# EAGLE design Nivel_inferior (EAGLE 7.6.0)
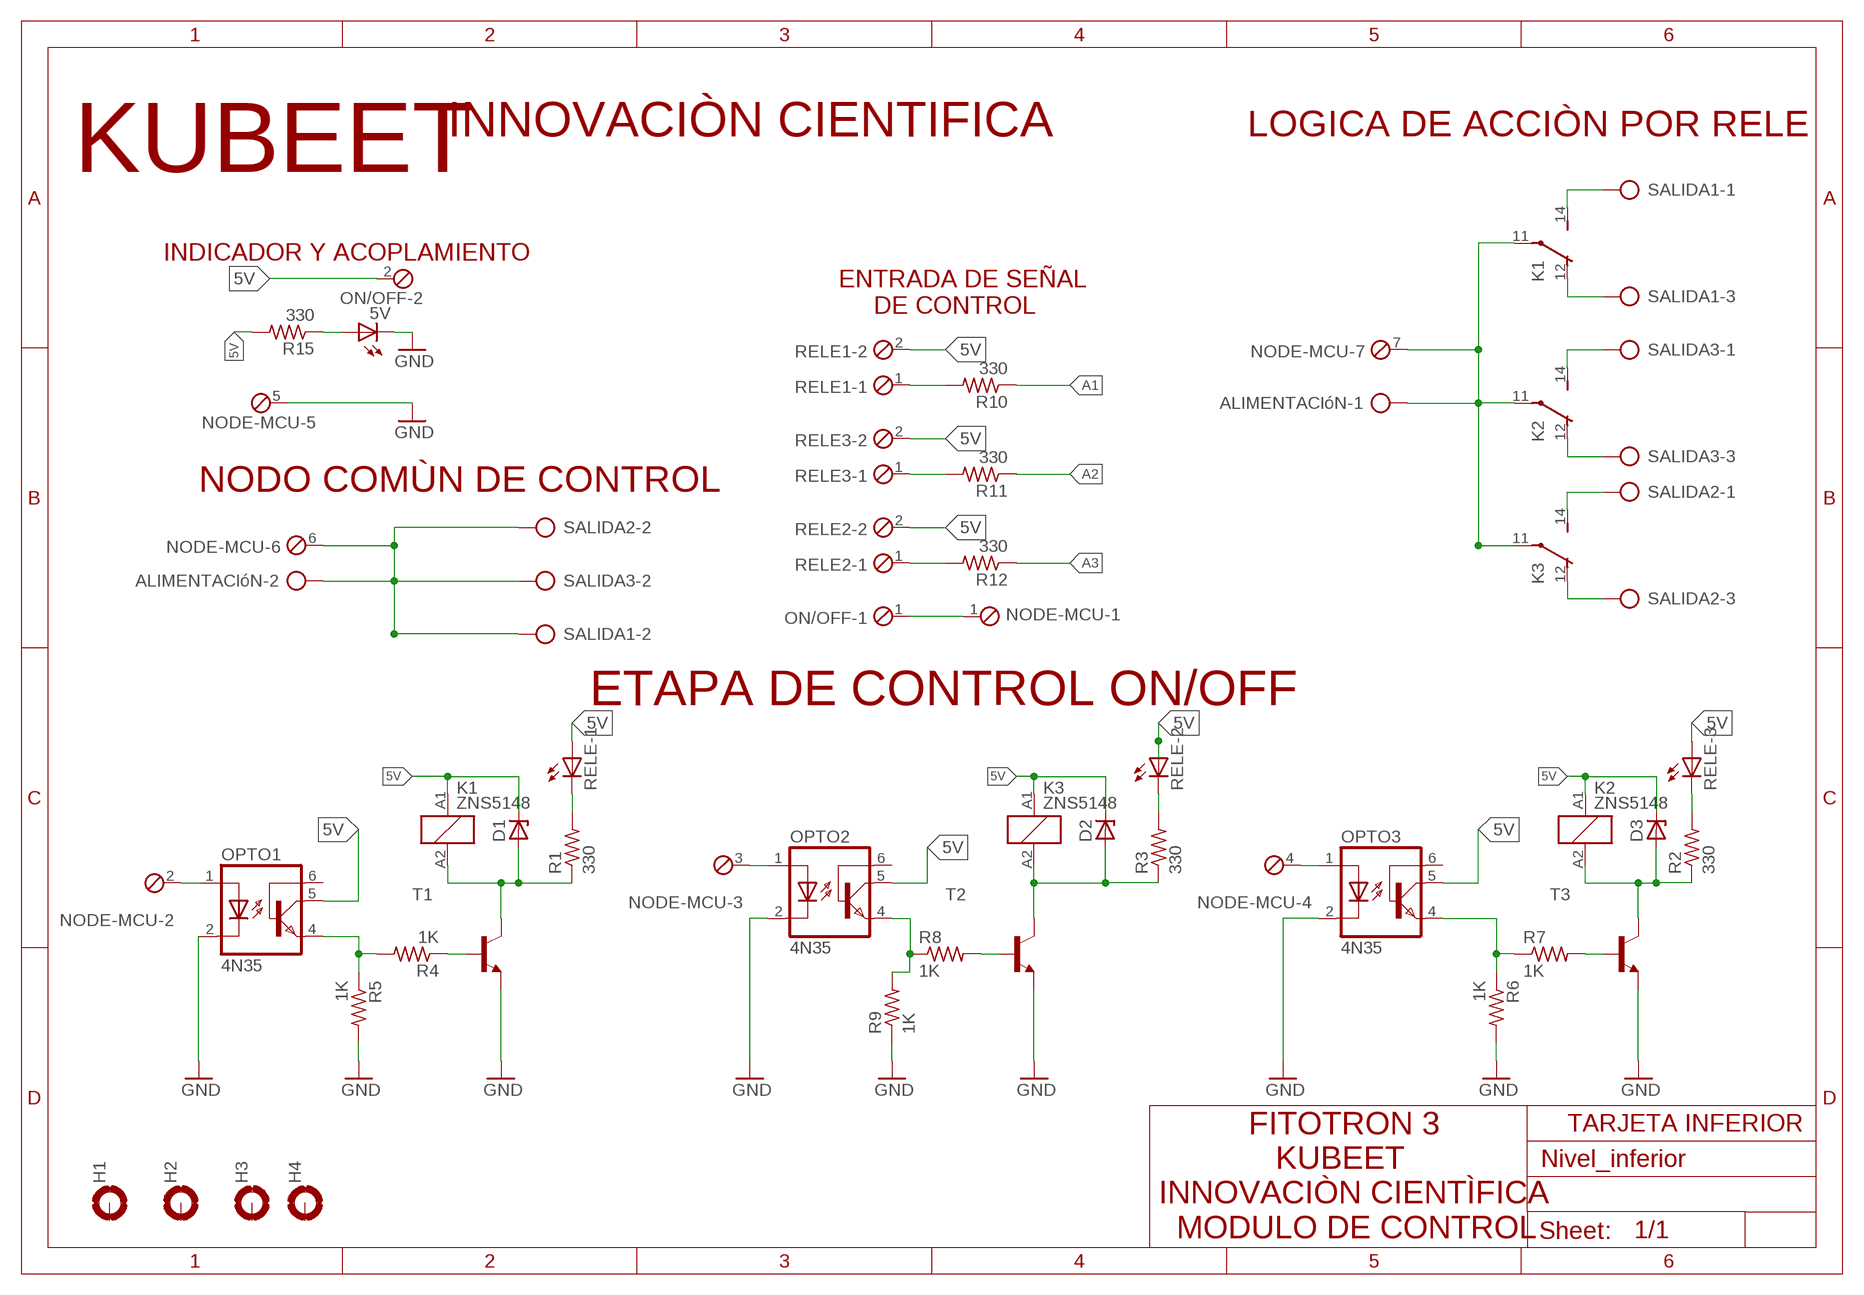
[diagram p0: schematic, sheet 1]

## Parts
5V  LED5MM  [LED5MM]
ALIMENTACIóN  AK300/2  [AK300/2]
D1  1N821  [DO35Z10]
D2  1N821  [DO35Z10]
D3  1N821  [DO35Z10]
H1  MOUNT-PAD-ROUND3.6  [3,6-PAD]
H2  MOUNT-PAD-ROUND3.6  [3,6-PAD]
H3  MOUNT-PAD-ROUND3.6  [3,6-PAD]
H4  MOUNT-PAD-ROUND3.6  [3,6-PAD]
K1  ZNS5148  [ZN5]
K2  ZNS5148  [ZN5]
K3  ZNS5148  [ZN5]
NODE-MCU  MPT7  [7POL254]
ON/OFF  MPT2  [2POL254]
OPTO1  4N35  [DIL06]
OPTO2  4N35  [DIL06]
OPTO3  4N35  [DIL06]
R1  330  R-US_0207/7  [0207/7]
R2  330  R-US_0207/7  [0207/7]
R3  330  R-US_0207/7  [0207/7]
R4  1K  R-US_0207/7  [0207/7]
R5  1K  R-US_0207/7  [0207/7]
R6  1K  R-US_0207/7  [0207/7]
R7  1K  R-US_0207/7  [0207/7]
R8  1K  R-US_0207/7  [0207/7]
R9  1K  R-US_0207/7  [0207/7]
R10  330  R-US_0207/7  [0207/7]
R11  330  R-US_0207/7  [0207/7]
R12  330  R-US_0207/7  [0207/7]
R15  330  R-US_0207/7  [0207/7]
RELE1  MPT2  [2POL254]
RELE2  MPT2  [2POL254]
RELE3  MPT2  [2POL254]
RELE-1  LED5MM  [LED5MM]
RELE-2  LED5MM  [LED5MM]
RELE-3  LED5MM  [LED5MM]
SALIDA1  AK300/3  [AK300/3]
SALIDA2  AK300/3  [AK300/3]
SALIDA3  AK300/3  [AK300/3]
T1  2N2222-NPN-TO92-EBC  [TO92-EBC]
T2  2N2222-NPN-TO92-EBC  [TO92-EBC]
T3  2N2222-NPN-TO92-EBC  [TO92-EBC]

## Nets
5V: D1.C D2.C D3.C K1.A1 K2.A1 K3.A1 ON/OFF.2 OPTO1.5(COL) OPTO2.5(COL) OPTO3.5(COL) R15.2 RELE1.2 RELE2.2 RELE3.2 RELE-1.A RELE-2.A RELE-3.A
A: ALIMENTACIóN.1 K1.11(2:P) K2.11(2:P) K3.11(2:P) NODE-MCU.7
A1: NODE-MCU.2 OPTO1.1(A) R10.1
A2: NODE-MCU.4 OPTO3.1(A) R11.1
A3: NODE-MCU.3 OPTO2.1(A) R12.1
GND: 5V.K(C) NODE-MCU.5 OPTO1.2(C) OPTO2.2(C) OPTO3.2(C) R5.2 R6.2 R9.1 T1.E T2.E T3.E
N$1: ALIMENTACIóN.2 NODE-MCU.6 SALIDA1.2 SALIDA2.2 SALIDA3.2
N$4: K1.14(2:S) SALIDA1.1
N$5: K1.12(2:O) SALIDA1.3
N$6: K2.14(2:S) SALIDA3.1
N$7: K2.12(2:O) SALIDA3.3
N$8: K3.14(2:S) SALIDA2.1
N$9: K3.12(2:O) SALIDA2.3
N$10: NODE-MCU.1 ON/OFF.1
N$15: D1.A K1.A2 R1.1 T1.C
N$16: D3.A K2.A2 R2.1 T3.C
N$18: 5V.A R15.1
N$59: D2.A K3.A2 R3.1 T2.C
N$74: R12.2 RELE2.1
N$140: R1.2 RELE-1.K(C)
N$141: R2.2 RELE-3.K(C)
N$142: R3.2 RELE-2.K(C)
N$146: R7.2 T3.B
N$147: R4.1 T1.B
N$148: OPTO1.4(EMI) R4.2 R5.1
N$149: OPTO3.4(EMI) R6.1 R7.1
N$150: R8.2 T2.B
N$151: OPTO2.4(EMI) R8.1 R9.2
N$162: R11.2 RELE3.1
N$164: R10.2 RELE1.1
Unconnected: H1.B3,6(MOUNT) H2.B3,6(MOUNT) H3.B3,6(MOUNT) H4.B3,6(MOUNT) OPTO1.6(BAS) OPTO2.6(BAS) OPTO3.6(BAS)

## Notes on the sheet
- INNOVACIÒN CIENTIFICA | LOGICA DE ACCIÒN POR RELE
- KUBEET
- INDICADOR Y ACOPLAMIENTO
- ENTRADA DE SEÑAL 
       DE CONTROL
- NODO COMÙN DE CONTROL
- ETAPA DE CONTROL ON/OFF
- TARJETA INFERIOR
- FITOTRON 3
               KUBEET
  INNOVACIÒN CIENTÌFICA
    MODULO DE CONTROL

## Library data of the parts
5V RELE-1-RELE-3 = led:LED: LED OSRAM: - CHIPLED LG R971, LG N971, LY N971, LG Q971, LY Q971, LO R971, LY R971 LH N974, LH R974 LS Q976, LO Q976, LY Q976 LO Q996 - Hyper CHIPLED LW Q18S LB Q993, LB Q99A, LB R99A - SideLED LS A670, LO A670, LY A670, LG A670, LP A670 LB A673, LV A673, LT A673, LW A673 LH A674 LY A675 LS A676, LA A676, LO A676, LY A676, LW A676 LS A679, LY A679, LG A679 - Hyper Micro SIDELED® LS Y876, LA Y876, LO Y876, LY Y876 LT Y87S - SmartLED LW L88C, LW L88S LB L89C, LB L89S, LG L890 LS L89K, LO L89K, LY L89K LS L896, LA L896, LO L896, LY L896 - TOPLED LS T670, LO T670, LY T670, LG T670, LP T670 LSG T670, LSP T670, LSY T670, LOP T670, LYG T670 LG T671, LOG T671, LSG T671 LB T673, LV T673, LT T673, LW T673 LH T674 LS T676, LA T676, LO T676, LY T676, LB T676, LH T676, LSB T676, LW T676 LB T67C, LV T67C, LT T67C, LS T67K, LO T67K, LY T67K, LW E67C LS E67B, LA E67B, LO E67B, LY E67B, LB E67C, LV E67C, LT E67C LW T67C LS T679, LY T679, LG T679 LS T770, LO T770, LY T770, LG T770, LP T770 LB T773, LV T773, LT T773, LW T773 LH T774 LS E675, LA E675, LY E675, LS T675 LS T776, LA T776, LO T776, LY T776, LB T776 LHGB T686 LT T68C, LB T68C - Hyper Mini TOPLED® LB M676 - Mini TOPLED Santana® LG M470 LS M47K, LO M47K, LY M47K Source: http://www.osram.convergy.de LUXEON: - LUMILED® LXK2-PW12-R00, LXK2-PW12-S00, LXK2-PW14-U00, LXK2-PW14-V00 LXK2-PM12-R00, LXK2-PM12-S00, LXK2-PM14-U00 LXK2-PE12-Q00, LXK2-PE12-R00, LXK2-PE12-S00, LXK2-PE14-T00, LXK2-PE14-U00 LXK2-PB12-K00, LXK2-PB12-L00, LXK2-PB12-M00, LXK2-PB14-N00, LXK2-PB14-P00, LXK2-PB14-Q00 LXK2-PR12-L00, LXK2-PR12-M00, LXK2-PR14-Q00, LXK2-PR14-R00 LXK2-PD12-Q00, LXK2-PD12-R00, LXK2-PD12-S00 LXK2-PH12-R00, LXK2-PH12-S00 LXK2-PL12-P00, LXK2-PL12-Q00, LXK2-PL12-R00 Source: www.luxeon.com KINGBRIGHT: KA-3528ASYC Source: www.kingbright.com
ALIMENTACIóN = con-ptr500:AK300/2: CONNECTOR; OC_FARNELL: unknown; OC_NEWARK: unknown
D1-D3 = diode:1N821: Reference DIODE temperature compensated, 6,2 V
H1-H4 = holes:MOUNT-PAD-ROUND: MOUNTING PAD, round
K1-K3 = relay:ZNS5*: Miniature Power PCB Relay SCHRACK 1pole 10 A Source: http://www.schrack.com/.. 5847.pdf; OC_FARNELL: unknown; OC_NEWARK: unknown
NODE-MCU = con-phoenix-254:MPT7: PHOENIX CONNECTOR; OC_FARNELL: unknown; OC_NEWARK: unknown
ON/OFF RELE1-RELE3 = con-phoenix-254:MPT2: PHOENIX CONNECTOR; OC_FARNELL: unknown; OC_NEWARK: unknown
OPTO1-OPTO3 = optocoupler:4N35: MOTOROLA OPTO COUPLER; MF: FAIRCHILD SEMICONDUCTOR; MPN: 4N35; OC_FARNELL: 1328375; OC_NEWARK: 72K9946
R1-R12 R15 = rcl:R-US_: RESISTOR, American symbol
SALIDA1-SALIDA3 = con-ptr500:AK300/3: CONNECTOR; OC_FARNELL: unknown; OC_NEWARK: unknown
T1-T3 = transistor-neu-to92:*-NPN-: NPN Transistror

## Board
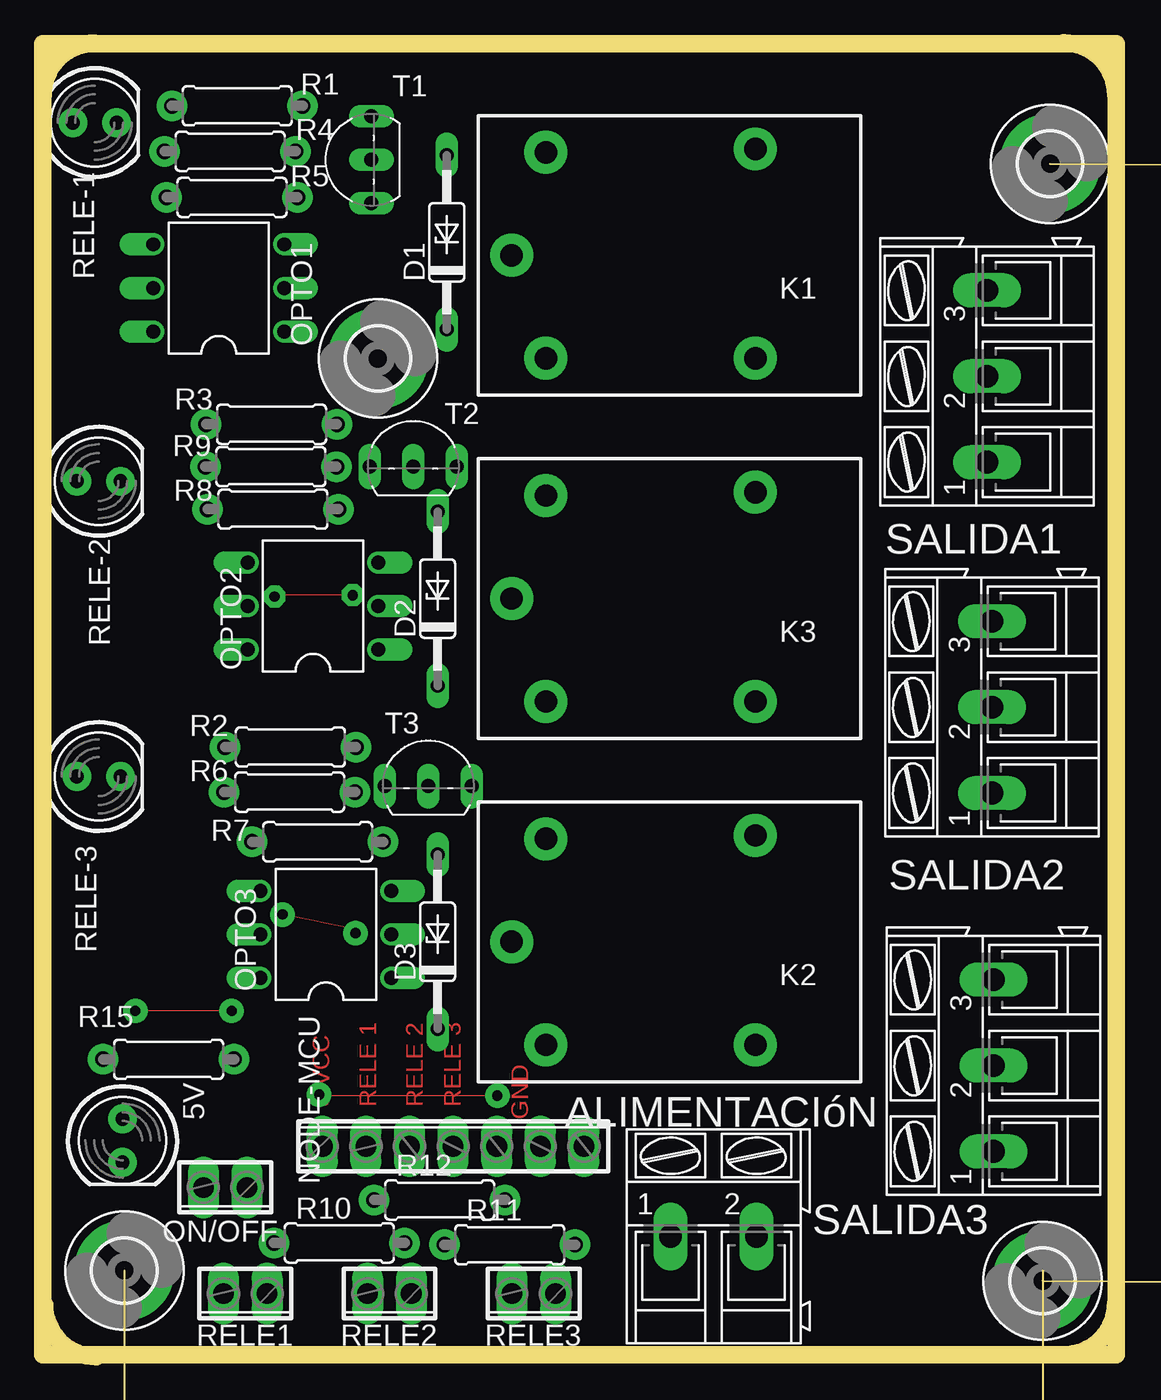
[diagram p1: board, top side]
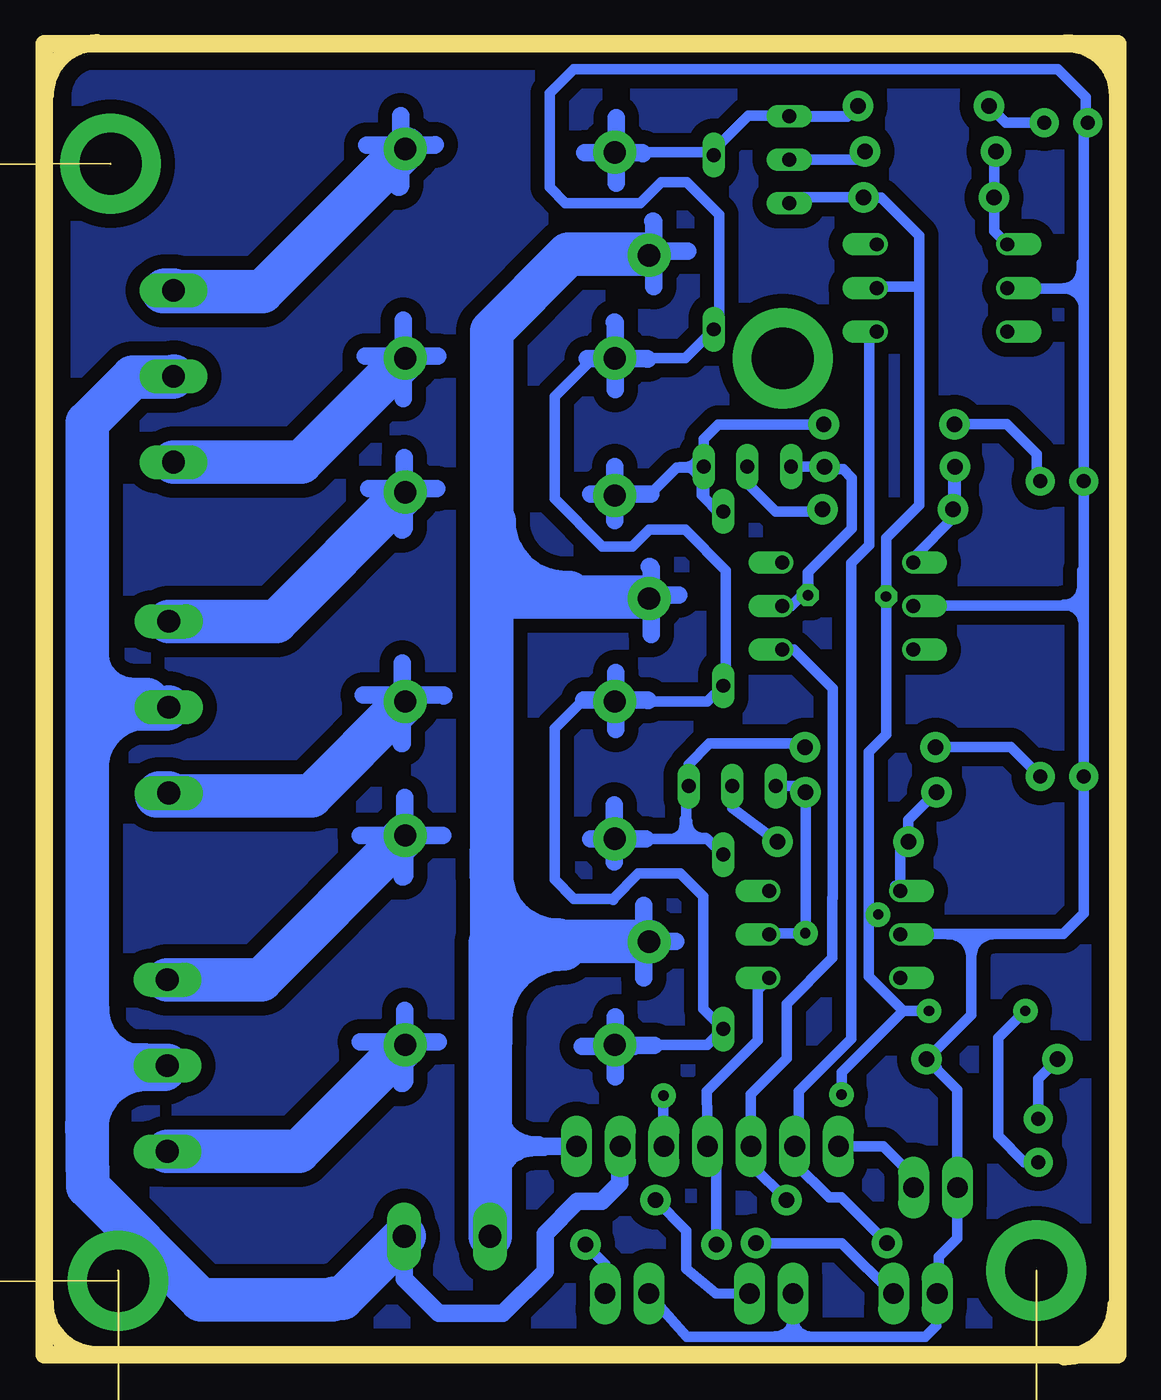
[diagram p2: board, bottom side, seen from below]

Size 62.52 x 76.55 mm. Coordinates in mm from the lower left corner, seen from the top.
Outline: 58.33,0.1 59.47,0.1 arc90 62.48,3.12
Outline: 0.1,3.02 arc90 3.11,0
Outline: 3.03,76.53 arc90 0.01,73.51
Outline: 62.48,73.53 arc90 59.46,76.55
Outline: 0,0.11 62.52,0.11 62.52,76.51 0,76.51 0,0.11
Copper layers (1*16): Top 0.035mm / dielectric 1.5mm / Bottom 0.035mm
Design rules "default": minimum track width 10mil, minimum drill 24mil, track to track 8mil, track to pad 8mil, pad to pad 8mil, via to via 8mil, smd to smd 8mil, copper to edge 40mil, drill to drill 8mil, minimum pad ring 10mil, minimum via ring 8mil, stop-mask expansion 4mil, vias tented up to drill 0mil, thermal gap 10mil
Milling: area 4.7,-8.8 to 6.2,-8.2; area 56.7,-8.8 to 58.2,-8.2; area 28,-8.1 to 35,-6.3; area 87,4.2 to 87.6,5.7; area 87.4,67.8 to 88,69.3; area 85.3,33.3 to 87.2,40.2; 6 lines

### Footprints (pad centres in the part's own frame; a part is rotated, then mirrored left to right if it is on the bottom)
LED5MM = drill 0.813 pad 1.676: A -1.27,0; K 1.27,0
AK300/2 = drill 1.321 long: 1 -2.515,0; 2 2.489,0
DO35Z10 = drill 0.813 long: A 5.08,0; C -5.08,0
3,6-PAD = drill 3.6 pad 5.842: B3,6 0,0
ZN5 = drill 1.3 pad 2.5: 11 8.89,0; 12 -5.31,-6.2; 14 -5.31,6; A1 6.89,6; A2 6.89,-6
7POL254 = drill 1.2 long: 1 -7.62,0; 2 -5.08,0; 3 -2.54,0; 4 0,0; 5 2.54,0; 6 5.08,0; 7 7.62,0
2POL254 = drill 1.2 long: 1 -1.27,0; 2 1.27,0
DIL06 = drill 0.813 offset: 1 -2.54,-3.81; 2 0,-3.81; 3 2.54,-3.81; 4 2.54,3.81; 5 0,3.81; 6 -2.54,3.81
0207/7 = drill 0.9 pad 1.778: 1 -3.81,0; 2 3.81,0
AK300/3 = drill 1.321 long: 1 -5.004,0; 2 0,0; 3 5.004,0
TO92-EBC = drill 0.813 long: B 0,-1.27; C 2.54,-1.27; E -2.54,-1.27

### Placement (x,y rotation side)
5V  4.64,12.59 270 top
ALIMENTACIóN  39.08,7.01 0 top
D1  23.52,64.93 90 top
D2  22.99,44.17 90 top
D3  22.99,24.17 90 top
H1  4.74,5.02 0 top
H2  58.23,4.42 0 top
H3  58.66,69.5 0 top
H4  19.51,58.16 0 top
K1  36.19,64.17 180 top
K2  36.19,24.17 180 top
K3  36.19,44.17 180 top
NODE-MCU  23.9,12.25 0 top
ON/OFF  10.62,9.86 180 top
OPTO1  10.24,62.27 90 top
OPTO2  15.73,43.74 90 top
OPTO3  16.48,24.6 90 top
R1  11.32,72.88 180 top
R2  14.42,35.52 180 top
R3  13.32,54.33 180 top
R4  10.9,70.23 180 top
R5  11.01,67.54 0 top
R6  14.37,32.89 0 top
R7  16,30 0 top
R8  13.4,49.38 0 top
R9  13.28,51.86 180 top
R10  17.26,6.62 0 top
R11  27.19,6.52 0 top
R12  23.11,9.12 0 top
R15  7.32,17.32 0 top
RELE1  11.79,3.67 180 top
RELE2  20.19,3.67 180 top
RELE3  28.59,3.67 180 top
RELE-1  3.02,71.9 0 top
RELE-2  3.25,51 0 top
RELE-3  3.25,33.8 0 top
SALIDA1  54.99,57.12 90 top
SALIDA2  55.28,37.84 90 top
SALIDA3  55.36,16.96 90 top
T1  17.87,69.74 90 top
T2  21.57,53.13 0 top
T3  22.45,34.51 0 top

### Tracks (layer width: path | path; a pad name or v marks a point on that pad's centre or on a via)
5V
  Bottom 0.406: 10.45,16.88 10.89,17.32 R15.2
  Bottom 0.61: K2.A1 23.91,18.17 D3.C 24.16,20.26 24.16,26.82 25.48,28.15 27.92,28.15 29.39,26.68 29.39,26.61 29.46,26.68 31.69,26.68 32.81,27.8 32.81,36.59 31.23,38.17 K3.A1 23.91,38.17 D2.C 22.83,39.24 22.83,45.81 25.21,48.18 27.3,48.18 28.27,47.2 30.02,47.2 32.81,49.99 32.81,55.93 30.56,58.17 K1.A1 25.21,58.17 D1.C 23.21,60.16 23.21,66.53 25.1,68.42 26.6,68.42 27.82,67.21 32.17,67.21 33.09,68.13 33.09,73.61 31.68,75.02 3.49,75.02 1.86,73.39 1.86,71.79 | RELE-1.A 1.86,71.79 | 1.98,62.23 1.98,71.67 1.86,71.79 | 1.98,62.23 RELE-2.A 1.98,43.76 | 1.98,43.76 1.98,33.39 2.3,33.71 RELE-3.A 1.98,25.83 3.18,24.63 8.54,24.63 | OPTO1.5 6.39,62.23 1.98,62.23 | OPTO2.5 11.9,43.76 1.98,43.76 | OPTO3.5 12.65,24.63 8.54,24.63 | 8.54,24.63 8.54,19.91 R15.2 9.35,15.54 ON/OFF.2 9.35,6.9 10.43,5.82 10.43,2.66 10.52,2.75 RELE1.2 10.56,3.32 10.56,1.8 11.22,1.15 18.87,1.15 | RELE3.2 25.1,1.15 18.87,1.15 | RELE2.2 18.87,3.32 18.87,1.15
A
  Bottom 1.016: NODE-MCU.7 36.37,12.25 36.56,12.06
  Bottom 2.54: K1.11 27.36,64.24 32,64.24 36.48,59.76 36.48,44.48 | 36.48,44.48 36.48,24.18 | K3.11 27.39,44.26 35.73,44.26 35.94,44.48 36.48,44.48 | K2.11 27.31,24.18 36.48,24.18 | ALIMENTACIóN.1 36.56,12.06 36.56,24.1 36.48,24.18
A1
  Bottom 0.61: OPTO1.1 14.48,59.73 14.48,47.27 15.52,46.24 15.52,18.51 18.59,15.44 18.59,12.82 NODE-MCU.2 18.82,11.27 16.82,9.27 16.1,9.27 R10.1
A2
  Bottom 0.61: OPTO3.1 20.98,21.37 20.98,18.43 23.95,15.46 NODE-MCU.4 23.38,11.74 R11.1
A3
  Bottom 0.61: OPTO2.1 18.88,41.2 16.6,38.92 16.6,26.71 16.62,26.71 16.62,23.22 19.28,20.56 19.28,17.37 21.37,15.28 21.37,12.58 NODE-MCU.3 21.36,11.19 R12.1
GND  (via drill 0.6 pad 1.27, 0.6 pad 1.42)
  Top 0: v10.99,20.14 v5.38,20.14 | v18.2,24.67 18.2,24.9 v13.96,25.76 | v18.05,44.37 13.58,44.37 v13.49,44.29 | v26.47,15.21 16.16,15.21 v16.09,15.27
  Bottom 0.406: 15.5,48.24 15.5,48.17 17.94,45.73 17.94,44.48 v18.05,44.37 | NODE-MCU.5 26.47,12.52
  Bottom 0.61: R6.2 18.53,33.24 T3.E | 18.18,26.71 R6.2 | T2.E R9.1 16.93,51.7 16,51.7 15.5,51.2 15.5,48.24 18.05,45.68 18.05,44.71 19.02,43.74 OPTO2.2 | T1.E 18.79,67.54 R5.2 14.8,67.52 13.78,67.52 11.57,65.31 11.57,62.35 | 11.57,62.35 11.57,49.61 13.49,47.68 v13.49,44.29 13.49,36.24 14.51,35.23 14.51,25.23 | 14.51,25.23 14.51,22.16 12.5,20.14 | 12.5,20.14 v10.99,20.14 | OPTO1.2 13.96,62.35 11.57,62.35 | R6.2 18.18,24.67 v18.2,24.67 20.29,24.67 OPTO3.2 | v13.96,25.76 14.51,25.23 | 5V.K 5.43,11.32 6.97,12.85 6.97,18.56 v5.38,20.14 | 26.47,12.52 v26.47,15.2 v26.47,15.21 | v16.09,15.27 16.09,16.55 12.5,20.14
N$1
  Bottom 1.016: NODE-MCU.6 29,12.22 29,10.11 30.06,9.05 31.48,9.05 33.36,7.17 33.36,4.98 35.82,2.52 39.56,2.52 41.56,4.53 ALIMENTACIóN.2
  Bottom 2.54: SALIDA1.2 55.04,57.08 57.37,57.08 60.03,54.42 60.03,37.18 | 60.03,37.18 60.03,20.34 60.02,20.33 60.02,17 | SALIDA3.2 56.65,16.96 56.69,17 60.02,17 | 60.02,17 60.02,10.95 60.01,10.95 60.01,9.92 53.4,3.32 45.73,3.32 45.66,3.39 45.18,3.39 ALIMENTACIóN.2 | SALIDA2.2 55.39,37.73 59.48,37.73 60.03,37.18
N$2
  Bottom 1.016: 33.73,12.34 33.93,12.34 arc90 36.09,14.5
N$3
  Bottom 2.54: 55.54,16.75 56.54,16.75 arc-90 60.07,13.21
N$4
  Bottom 2.54: K1.14 47.55,52.12 SALIDA1.1
N$5
  Bottom 2.54: K1.12 49.82,62.04 55.59,62.04 55.51,62.13 SALIDA1.3
N$6
  Bottom 2.54: K2.14 47.71,11.96 SALIDA3.1
N$7
  Bottom 2.54: K2.12 49.9,21.96 SALIDA3.3
N$8
  Bottom 2.54: K3.14 46.99,32.68 55.98,32.68 55.82,32.84 SALIDA2.1
N$9
  Bottom 2.54: K3.12 49.02,42.84 SALIDA2.3
N$10
  Bottom 0.61: NODE-MCU.1 13.67,12.24 11.89,10.46 ON/OFF.1
N$15
  Bottom 0.61: T1.C 15.74,72.28 R1.1 15.76,72.25 19.29,72.25 19.34,72.3 21.52,72.3 23.52,70.29 D1.A 23.68,70.17 26.81,70.17 27.33,70.17 K1.A2
N$16
  Bottom 0.61: D3.A 23.91,30.17 25.12,30.17 | 25.12,30.17 K2.A2 | R2.1 18.42,35.72 23.78,35.72 24.99,34.51 T3.C 25.12,33.11 25.12,30.17
N$18
  Bottom 0.61: R15.1 4.64,16.2 5V.A
N$22
  Bottom 2.54: 56.57,38.3 57.36,38.3 arc90 60.03,40.97
N$59
  Bottom 0.61: R3.1 17.14,54.31 23.27,54.31 24.11,53.47 T2.C 24.09,51.84 24.09,50.06 | 24.09,50.06 23.29,49.25 D2.A | 24.09,50.06 24.23,50.2 24.23,51.88 24.32,51.79 25.69,51.79 27.32,50.17 K3.A2
N$66
  Bottom 2.54: 56.2,37.8 56.54,37.8 arc-90 60.03,34.31
N$67
  Bottom 1.016: 33.43,12.18 34.02,12.18 arc-90 36.03,10.17 36.04,10.17
N$68
  Bottom 2.54: 55.82,16.85 56.61,16.85 arc90 60,20.24
N$71
  Bottom 2.54: 31.96,44.52 32.16,44.52 arc90 36.32,48.69
N$74
  Bottom 0.61: R12.2 25.13,7.33 25.13,5.1 23.42,3.69 RELE2.1
N$86
  Bottom 0.61: 17.38,1.16 17.93,1.16 arc90 18.9,2.27 18.9,2.22 arc90 19.94,1.18
N$99
  Bottom 2.54: 32.63,24.27 arc90 36.48,28.12 36.48,29.41
N$100
  Bottom 2.54: 32.27,23.76 arc-90 36.53,19.49 36.53,18.36
N$101
  Bottom 1.016: 39.57,18.32 44.13,18.32
N$102
  Bottom 1.016: 41.73,15.92 arc-90 41.54,16.1 41.54,20.18
N$103
  Bottom 1.016: 41.66,27.95 arc-90 41.54,28.07 41.54,32.58
N$104
  Bottom 1.016: 39.32,30.36 44.13,30.36
N$105
  Bottom 1.016: 39.26,38.5 arc-90 39.32,38.56 43.95,38.56
N$106
  Bottom 1.016: 41.73,35.72 arc-90 41.66,35.79 41.66,40.41
N$107
  Bottom 1.016: 29.33,32.15 29.33,28.81
N$108
  Bottom 1.016: 27.48,30.17 30.69,30.17
N$109
  Bottom 1.016: 28.16,18.08 31.18,18.08
N$110
  Bottom 1.016: 29.27,16.29 29.27,19.8
N$111
  Bottom 1.016: 26.99,18.14 28.84,18.14
N$112
  Bottom 1.016: 27.36,38.23 arc-90 27.4,38.26 31.11,38.26
N$113
  Bottom 1.016: 29.25,39.87 29.25,36.55
N$114
  Bottom 1.016: 27.21,50.27 30.69,50.27
N$115
  Bottom 1.016: 29.29,51.87 29.29,48.72
N$116
  Bottom 1.016: 29.21,72.19 29.21,68.37
N$117
  Bottom 1.016: 27.67,70.09 arc-90 27.73,70.16 31.06,70.16
N$118
  Bottom 1.016: 29.33,60.28 arc90 29.27,60.22 29.27,56.33
N$119
  Bottom 1.016: 27.39,58.12 arc-90 27.42,58.14 30.9,58.14
N$120
  Bottom 1.016: 27.08,66.17 arc90 27.04,66.13 27.04,62.35
N$121
  Bottom 1.016: 25.04,64.42 29.22,64.42
N$122
  Bottom 1.016: 39.76,70.62 arc90 39.81,70.58 43.74,70.58
N$123
  Bottom 1.016: 41.9,68.14 arc-90 41.77,68.27 41.77,72.3
N$124
  Bottom 1.016: 39.61,58.3 43.83,58.3
N$125
  Bottom 1.016: 41.62,60.41 41.62,55.83
N$126
  Bottom 1.016: 39.66,50.59 43.62,50.59
N$127
  Bottom 1.016: 41.72,48.17 arc-90 41.56,48.33 41.56,52.39
N$135
  Bottom 1.016: 25.57,44.36 29.39,44.36 arc-90 29.46,44.3
N$136
  Bottom 1.016: 27.17,42.08 27.17,45.91 arc-90 27.3,46.03
N$137
  Bottom 1.016: 25.74,24.2 28.96,24.2 arc90 29,24.25
N$138
  Bottom 1.016: 27.62,22.07 27.62,26.28
N$139
  pour Bottom (isolate 0.813): 0.66,0 62.35,0 62.35,76.61 -0.26,76.61 -0.26,2.21
N$140
  Bottom 0.61: R1.2 6.53,71.9 RELE-1.K
N$141
  Bottom 0.61: RELE-3.K 6.24,35.52 R2.2
N$142
  Bottom 0.61: RELE-2.K 4.71,51.19 4.71,52.58 6.46,54.33 R3.2
N$146
  Bottom 0.61: R7.2 22.45,31.96 T3.B
N$147
  Bottom 0.61: R4.1 15.2,69.74 T1.B
N$148
  Bottom 0.61: R4.2 7.2,70.06 R5.1 7.2,65.58 OPTO1.4
N$149
  Bottom 0.61: 12.97,27.44 OPTO3.4 12.67,29.51 R7.1 12.19,31.26 R6.1
N$150
  Bottom 0.61: R8.2 17.34,49.25 19.93,49.25 21.57,50.89 T2.B
N$151
  Bottom 0.61: R8.1 9.59,51.74 R9.2 9.42,51.81 9.42,49.03 11.92,46.53 OPTO2.4
N$153
  Bottom 0.61: 7.22,24.62 arc-90 8.53,23.25 | 8.53,23.25 8.53,22.89 | 8.53,23.25 8.53,23.28 arc-90 9.86,24.61
N$156
  Bottom 0.61: 25.22,31.29 25.22,31.01 arc90 26.08,30.15
N$157
  Bottom 0.61: 24.01,30.21 24.13,30.21 arc90 25.09,31.18
N$158
  Bottom 0.61: 24.39,52.63 arc90 25.2,51.83 25.47,51.83
N$159
  Bottom 0.61: 25.48,51.83 25.17,51.83 arc90 24.45,51.1
N$160
  Bottom 0.61: 2.1,63.73 2.1,63.36 arc90 3.22,62.24 3.16,62.24 arc90 1.97,61.05
N$161
  Bottom 0.61: 2.08,45.79 2.08,44.85 arc90 3.12,43.81 arc90 1.98,42.67 1.98,42.32
N$162
  Bottom 0.61: R11.2 29.86,5.38 RELE3.1
N$164
  Bottom 0.61: R10.2 21.07,6.61 16.07,6.61 13.06,3.6 RELE1.1

### Text on the board
Top: 5 VCC | RELE 1 | RELE 2 | RELE 3 | GND